# EasyEDA Pro project LED鼻子＆嘴巴.eprj

# Schematic Schematic1
Create Date: 2025-06-18; Page Name: P1; Project Name: LED鼻子＆嘴巴; Schematic Name: Schematic1; Update Date: 2025-06-18; Company: 嘉立创EDA; Page Size: A4; Version: V1.0
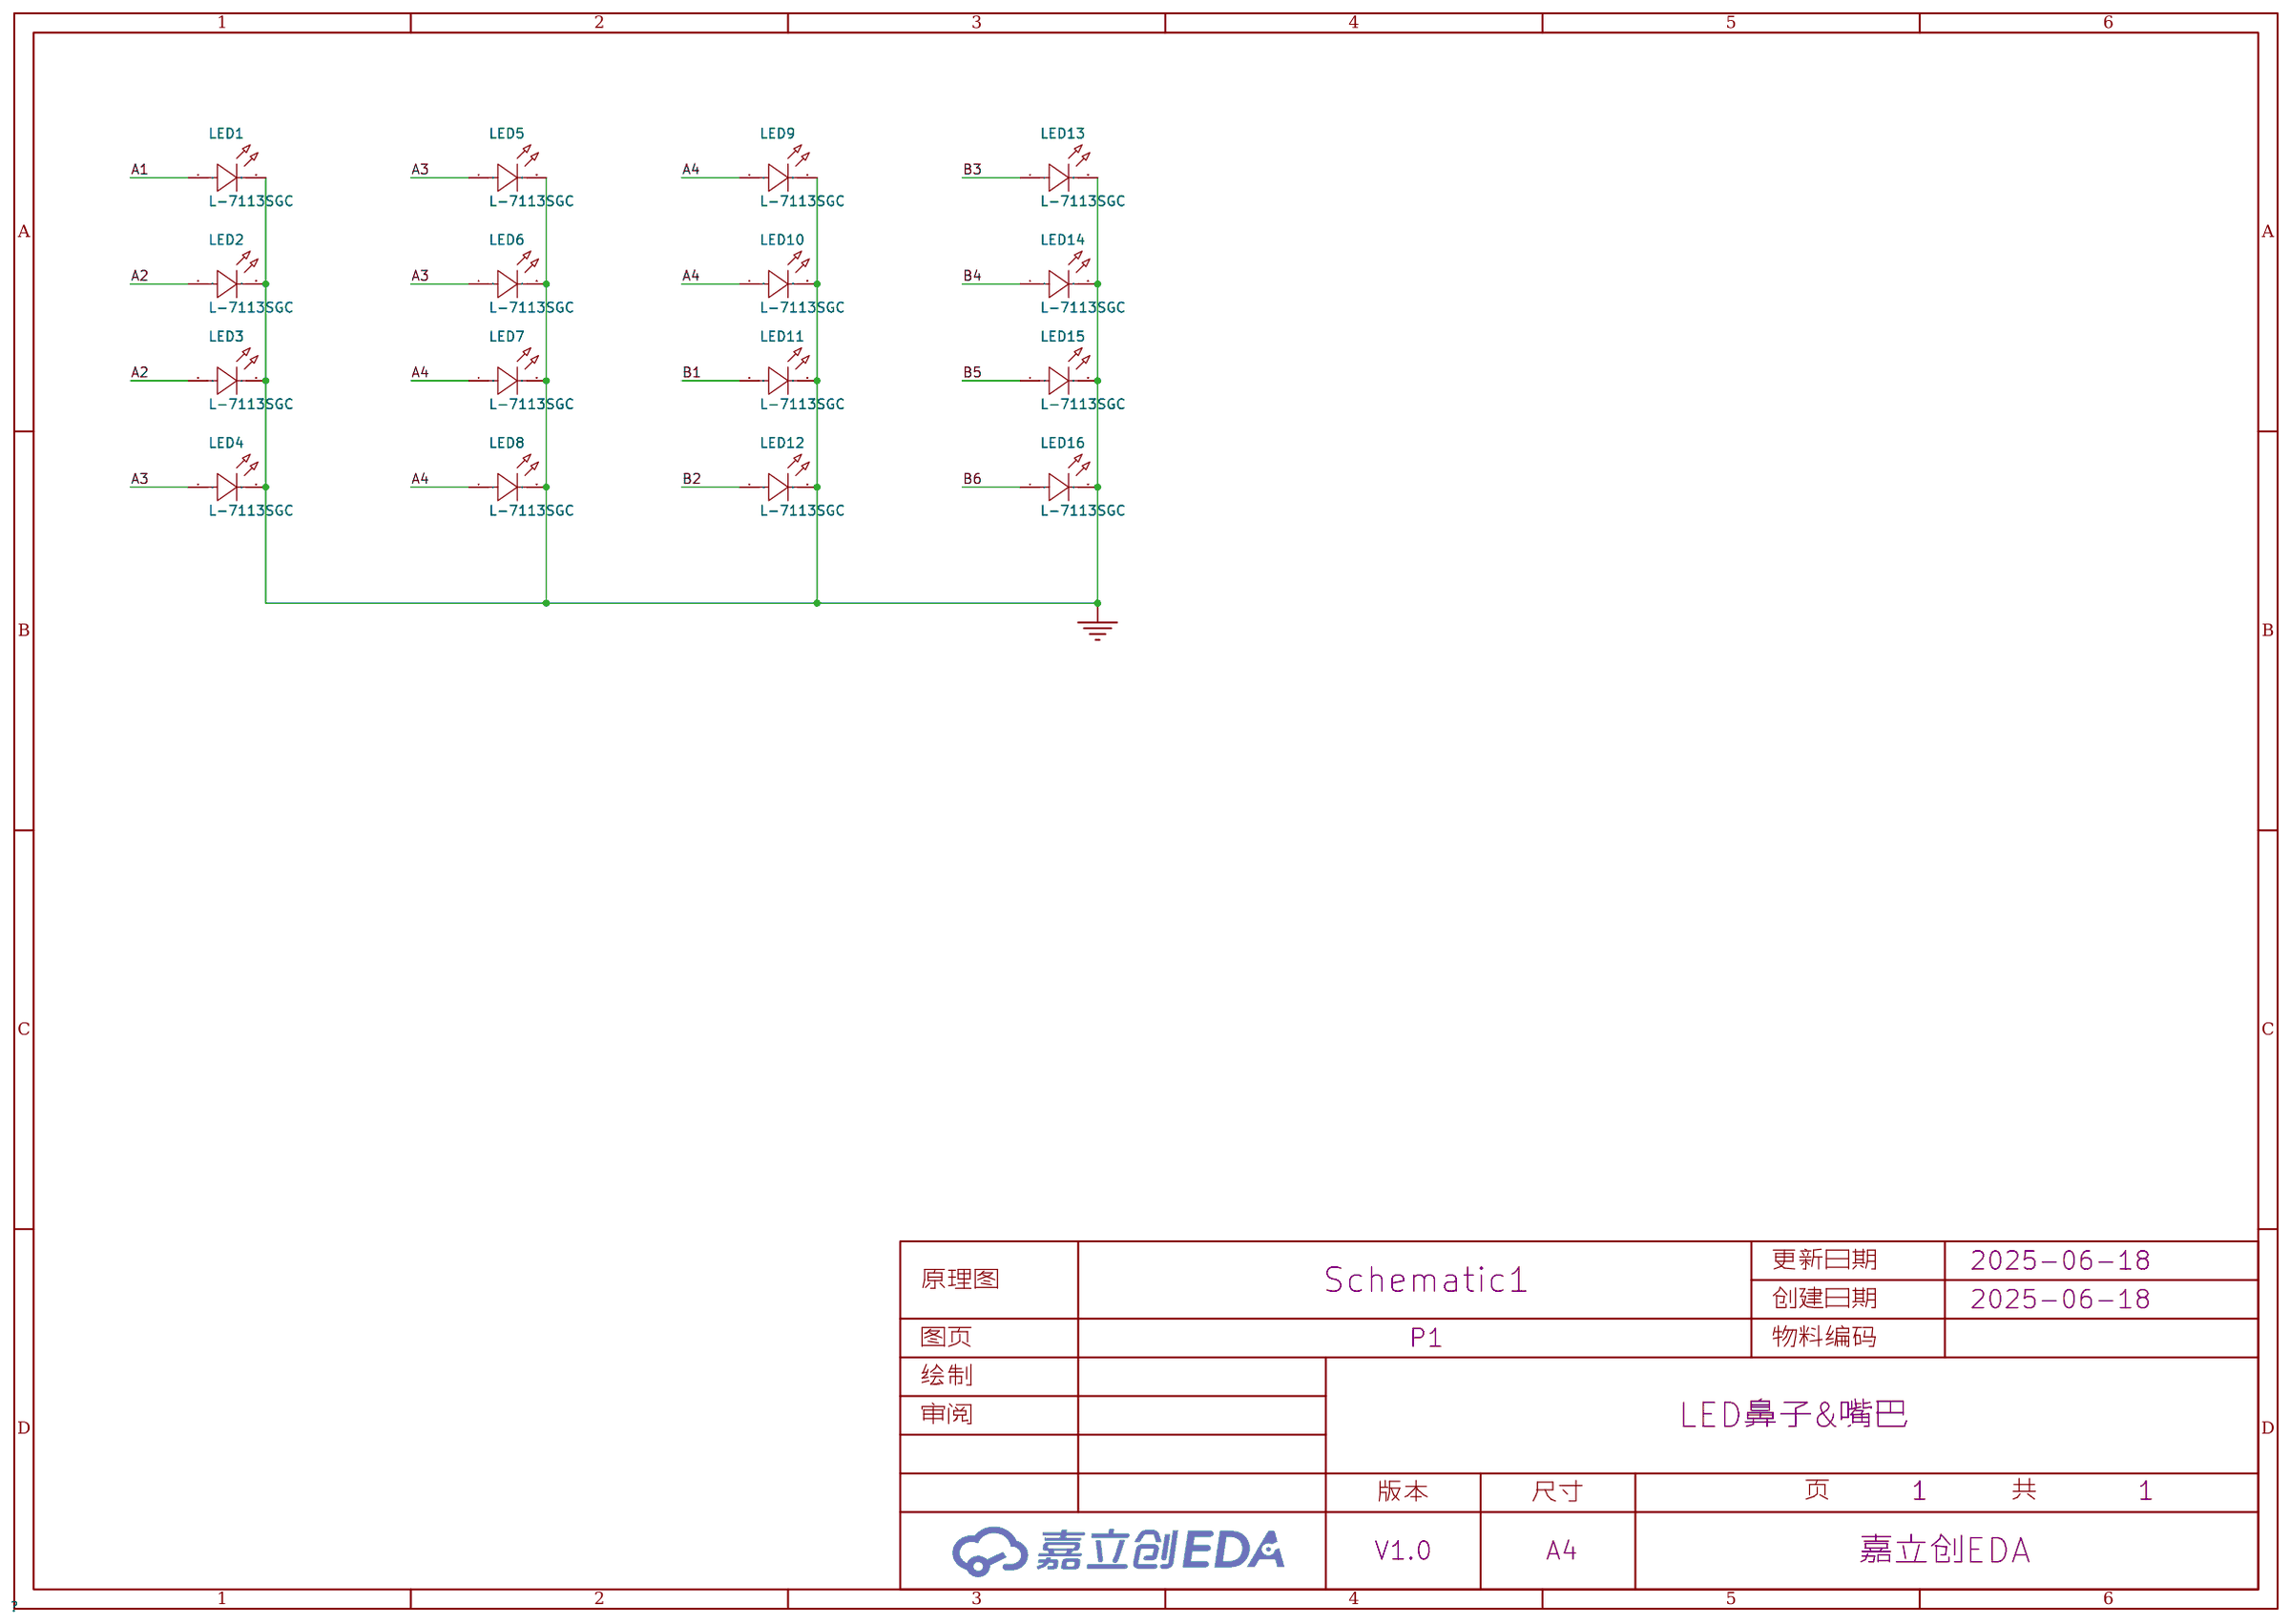
[diagram p0: schematic sheet]

## Parts
LED1  L-7113SGC  [LED-TH_BD5.9-P2.54-FD]
LED2  L-7113SGC  [LED-TH_BD5.9-P2.54-FD]
LED3  L-7113SGC  [LED-TH_BD5.9-P2.54-FD]
LED4  L-7113SGC  [LED-TH_BD5.9-P2.54-FD]
LED5  L-7113SGC  [LED-TH_BD5.9-P2.54-FD]
LED6  L-7113SGC  [LED-TH_BD5.9-P2.54-FD]
LED7  L-7113SGC  [LED-TH_BD5.9-P2.54-FD]
LED8  L-7113SGC  [LED-TH_BD5.9-P2.54-FD]
LED9  L-7113SGC  [LED-TH_BD5.9-P2.54-FD]
LED10  L-7113SGC  [LED-TH_BD5.9-P2.54-FD]
LED11  L-7113SGC  [LED-TH_BD5.9-P2.54-FD]
LED12  L-7113SGC  [LED-TH_BD5.9-P2.54-FD]
LED13  L-7113SGC  [LED-TH_BD5.9-P2.54-FD]
LED14  L-7113SGC  [LED-TH_BD5.9-P2.54-FD]
LED15  L-7113SGC  [LED-TH_BD5.9-P2.54-FD]
LED16  L-7113SGC  [LED-TH_BD5.9-P2.54-FD]

## Library data of the parts
LED1-LED16 = L-7113SGC: Supplier Part: C598455; Manufacturer: Kingbright; Supplier Footprint: 插件; JLCPCB Part Class: 扩展库; Datasheet: https://atta.szlcsc.com/upload/public/pdf/source/20250423/1662BB5EE7BFA789B9DB59295C7166F0.pdf; Supplier: LCSC

## Nets
GND: LED1.2 LED2.2 LED3.2 LED4.2 LED5.2 LED6.2 LED7.2 LED8.2 LED9.2 LED10.2 LED11.2 LED12.2 LED13.2 LED14.2 LED15.2 LED16.2
A1: LED1.1
A2: LED2.1 LED3.1
A3: LED4.1 LED5.1 LED6.1
A4: LED7.1 LED8.1 LED9.1 LED10.1
B1: LED11.1
B2: LED12.1
B3: LED13.1
B4: LED14.1
B5: LED15.1
B6: LED16.1

# Board PCB1
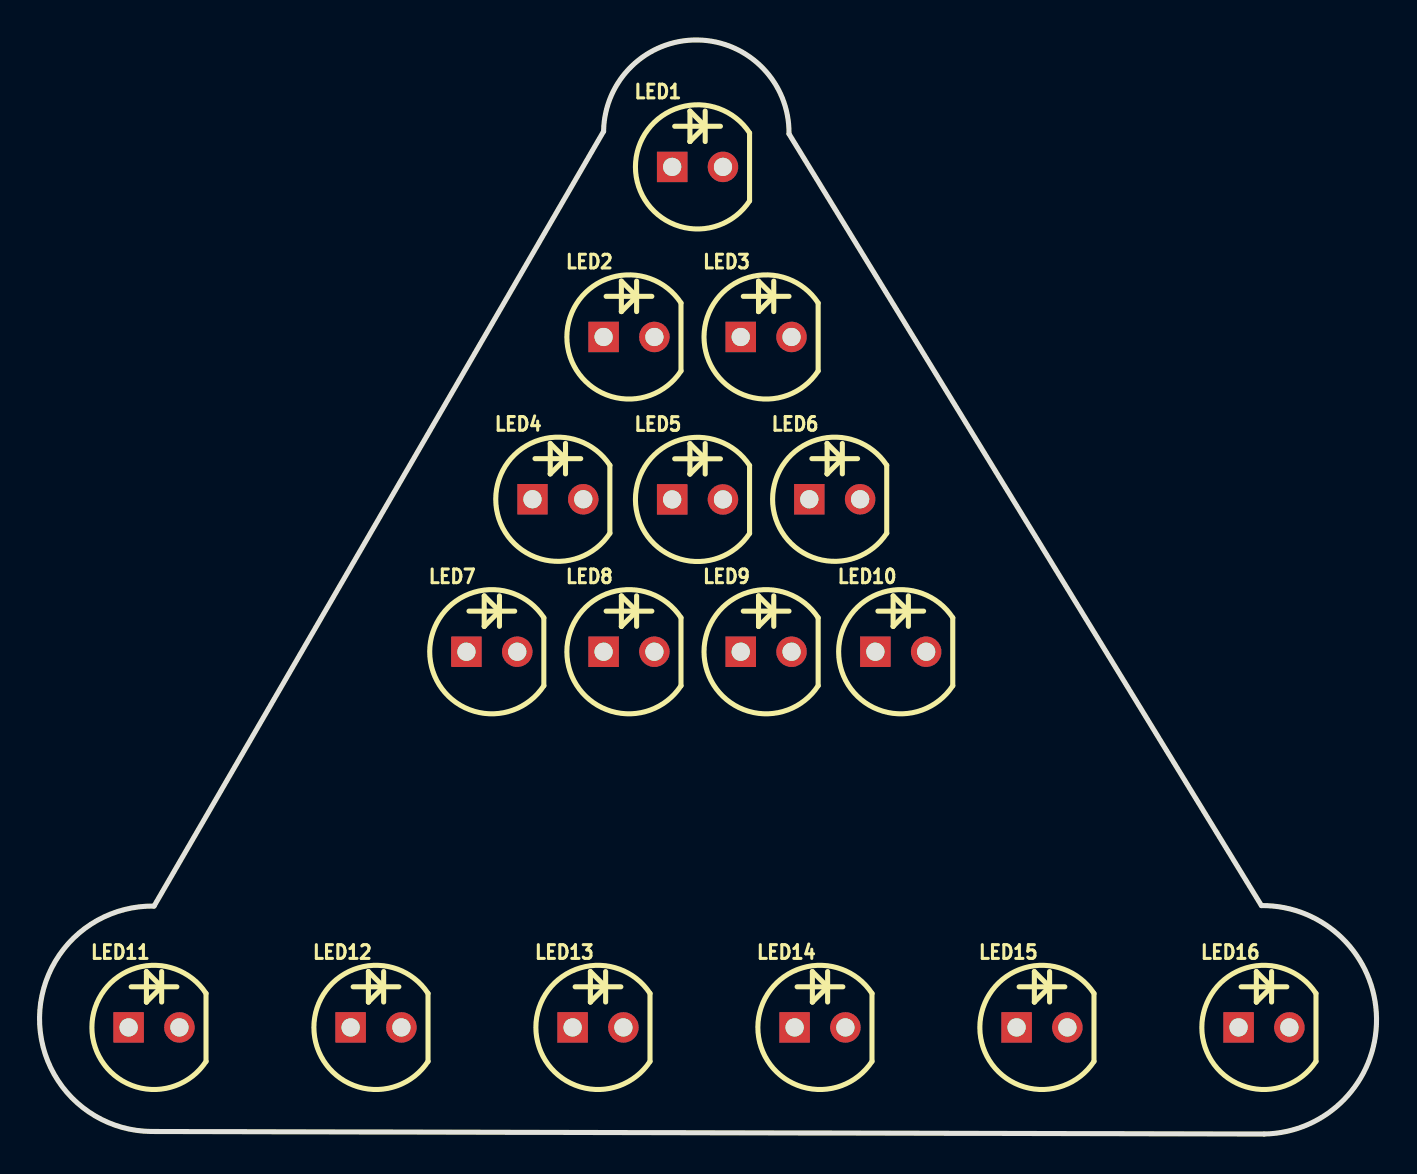
[diagram p1: board, top side]
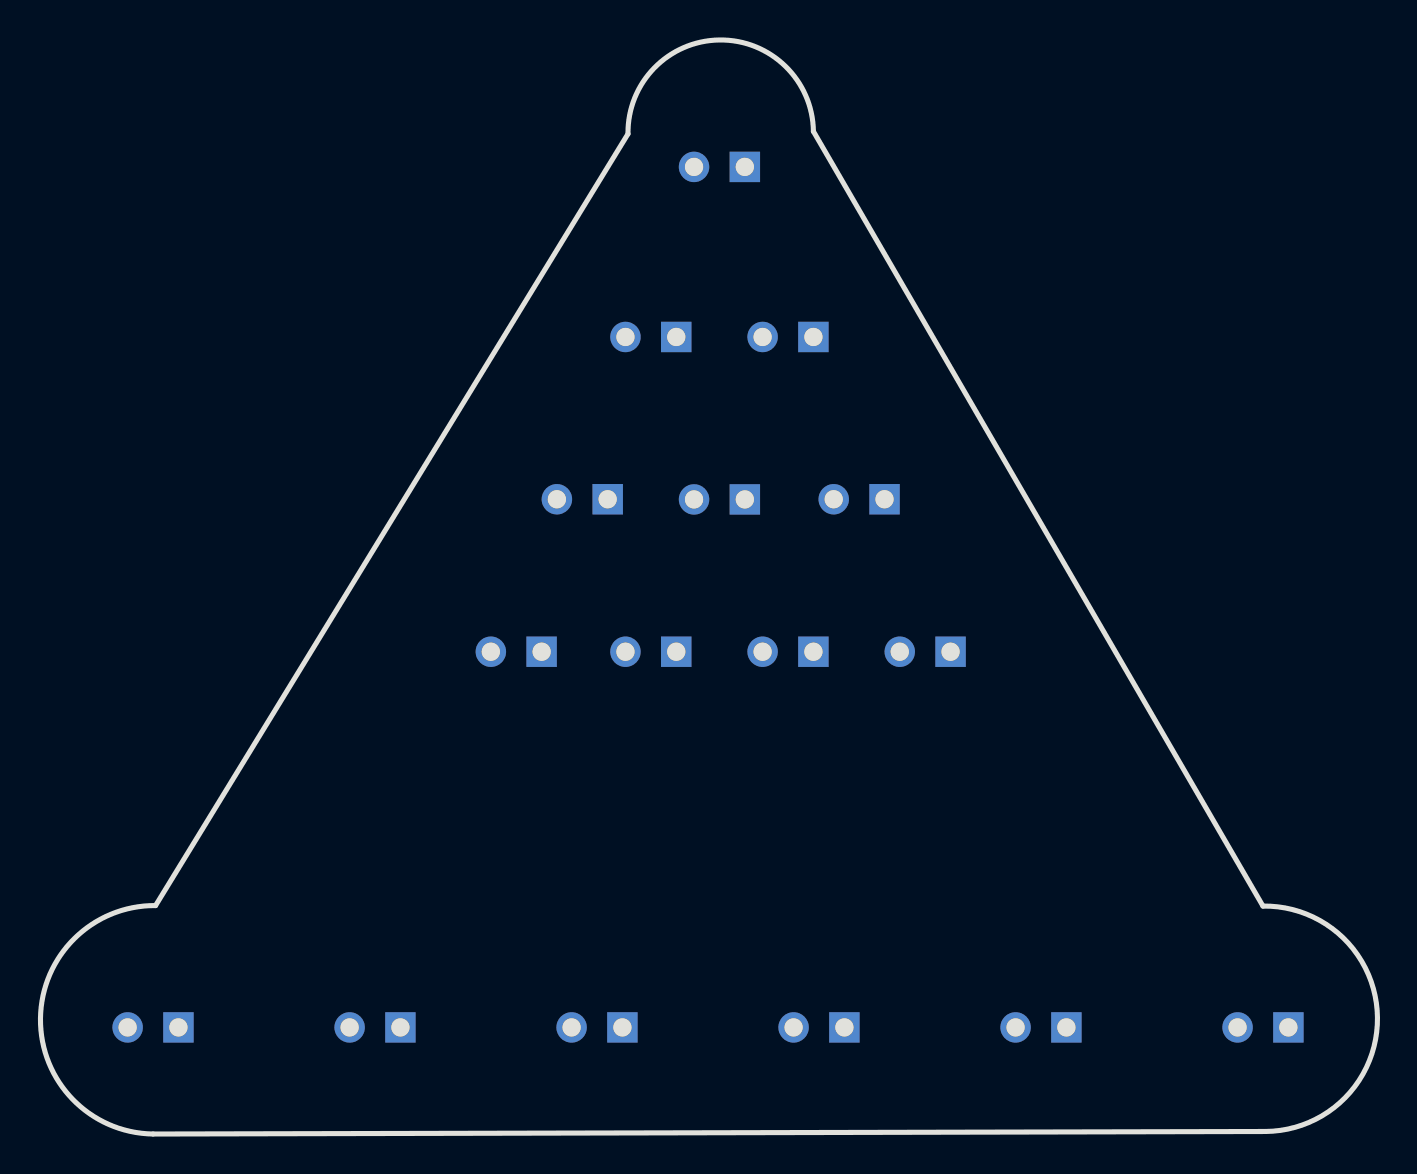
[diagram p2: board, bottom side, seen from below]

Outline 66.85 x 54.74 mm; copper layers: Top Layer, Inner9, Inner10, Inner11, Inner12, Inner13, Inner14, Inner15, Inner16, Inner17, Inner18, Inner19, Inner20, Inner21, Inner22, Inner23, Inner24, Inner25, Inner26, Inner27, Inner28, Inner29, Inner30, Bottom Layer. Coordinates in mm from the lower left corner of the outline.
Outline path: 5.58,0.13 arc(0,5.83) 5.7,11.4 28.18,50.17 arc(32.88,54.74) 37.45,50.04 61.07,11.43 arc(66.85,5.78) 61.2,0 5.58,0.13
Stack: Top Layer 0.035mm / Dielectric1 1.51mm FR4 er 4.5 / Bottom Layer 0.035mm

## Design rules (mm)
template: JLCPCB Capability(Two Layers Board)
spacing copperThickness1oz (default): track to track 0.102, other pairs 0.152 to 0.3
spacing copperThickness2oz: track to track 0.203, other pairs 0.152 to 0.3
track width copperThickness1oz (default): min 0.127, default 0.254, max 2.54
track width copperThickness2oz: min 0.203, default 0.254, max 2.54
differential pair differentialPair (default): width min 0.127, default 0.254, max 2.54; gap min 0.152, default 0.152
via viaSize (default): diameter min 0.5, default 0.61, max 10; hole min 0.3, default 0.305, max 6.3

## Placement (name value [footprint] x y rotation side)
LED1  L-7113SGC  [LED-TH_BD5.9-P2.54-FD]  32.88 48.39 0 top
LED2  L-7113SGC  [LED-TH_BD5.9-P2.54-FD]  29.45 39.88 0 top
LED3  L-7113SGC  [LED-TH_BD5.9-P2.54-FD]  36.31 39.88 0 top
LED4  L-7113SGC  [LED-TH_BD5.9-P2.54-FD]  25.9 31.76 0 top
LED5  L-7113SGC  [LED-TH_BD5.9-P2.54-FD]  32.88 31.75 0 top
LED6  L-7113SGC  [LED-TH_BD5.9-P2.54-FD]  39.74 31.76 0 top
LED7  L-7113SGC  [LED-TH_BD5.9-P2.54-FD]  22.59 24.13 0 top
LED8  L-7113SGC  [LED-TH_BD5.9-P2.54-FD]  29.45 24.13 0 top
LED9  L-7113SGC  [LED-TH_BD5.9-P2.54-FD]  36.31 24.13 0 top
LED10  L-7113SGC  [LED-TH_BD5.9-P2.54-FD]  43.04 24.13 0 top
LED11  L-7113SGC  [LED-TH_BD5.9-P2.54-FD]  5.7 5.33 0 top
LED12  L-7113SGC  [LED-TH_BD5.9-P2.54-FD]  16.8 5.33 0 top
LED13  L-7113SGC  [LED-TH_BD5.9-P2.54-FD]  27.9 5.33 0 top
LED14  L-7113SGC  [LED-TH_BD5.9-P2.54-FD]  39 5.33 0 top
LED15  L-7113SGC  [LED-TH_BD5.9-P2.54-FD]  50.1 5.33 0 top
LED16  L-7113SGC  [LED-TH_BD5.9-P2.54-FD]  61.2 5.33 0 top

## Footprints (pads in the part's own frame, mm; a bottom-side part is the same pattern mirrored in y, then rotated)
LED-TH_BD5.9-P2.54-FD
  rect 1.524x1.524 hole 0.914: 1(-1.27,0)
  round 1.524 hole 0.914: 2(1.27,0)

## Nets
As in the schematic.
